# Altium schematic sheet MCU.SchDoc
size A4; SheetNumber: 5; SheetTotal: 9
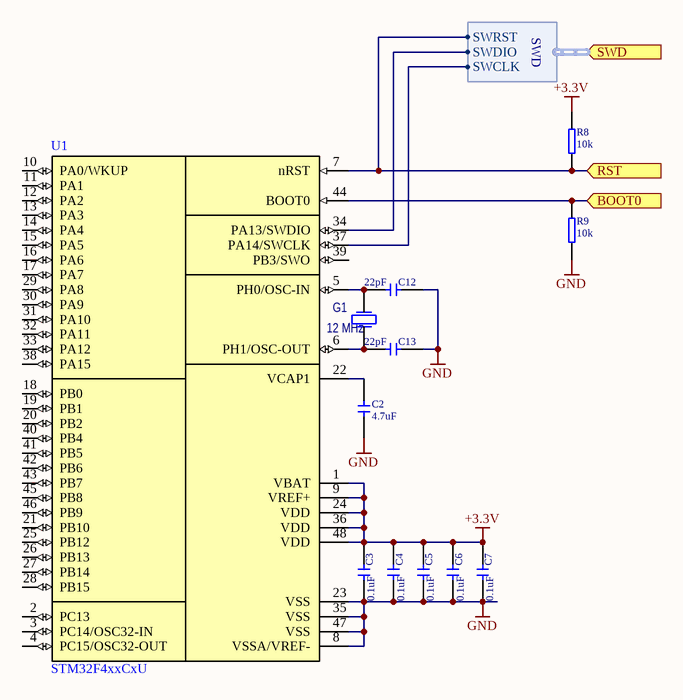
[diagram p0: MCU.SchDoc]

## Parts
C2  value 4.7uF  [CERCAP 0603]
C3  value 0.1uF  [CERCAP 0402]
C4  value 0.1uF  [CERCAP 0402]
C5  value 0.1uF  [CERCAP 0402]
C6  value 0.1uF  [CERCAP 0402]
C7  value 0.1uF  [CERCAP 0402]
C12  value 22pF  [CERCAP 0402]
C13  value 22pF  [CERCAP 0402]
G1  value 12 MHz  [3225]
R8  value 10k  [RES 0402]
R9  value 10k  [RES 0402]
U1  STM32F4xxCxU  [QFN-48]

## Ports
BOOT0 (in), RST (in), SWD (in, harness SWD)

## Harnesses
SWD: SWDIO, SWCLK, SWRST

## Nets
+3.3V: C3.2 C4.2 C5.2 C6.2 C7.2 R8.2 U1.1(VBAT) U1.9(VREF+) U1.24(VDD) U1.36(VDD) U1.48(VDD)
GND: C2.1 C3.1 C4.1 C5.1 C6.1 C7.1 C12.2 C13.2 R9.1 U1.8(VSSA/VREF-) U1.23(VSS) U1.35(VSS) U1.47(VSS)
BOOT0: R9.2 U1.44(BOOT0) ; port BOOT0
RST: R8.1 U1.7(nRST) ; port RST, port SWD.SWRST
NetC2_2: C2.2 U1.22(VCAP1)
NetC12_1: C12.1 G1.2 U1.5(PH0/OSC-IN)
NetC13_1: C13.1 G1.1 U1.6(PH1/OSC-OUT)
NetU1_34: U1.34(PA13/SWDIO) ; port SWD.SWDIO
NetU1_37: U1.37(PA14/SWCLK) ; port SWD.SWCLK

Not connected (* = marked no-connect by the designer): U1 2(PC13) 3(PC14/OSC32-IN) 4(PC15/OSC32-OUT) 10(PA0/WKUP) 11(PA1) 12(PA2) 13(PA3) 14(PA4) 15(PA5) 16(PA6) 17(PA7) 18(PB0) 19(PB1) 20(PB2) 21(PB10) 25(PB12) 26(PB13) 27(PB14) 28(PB15) 29(PA8) 30(PA9) 31(PA10) 32(PA11) 33(PA12) 38(PA15) 39(PB3/SWO) 40(PB4) 41(PB5) 42(PB6) 43(PB7) 45(PB8) 46(PB9)

## Library data of the parts
C2-C7 C12 C13 = !Capacitor: Capacitor; IsSMT: NoSMT; Diel: X7R; Voltage: *
G1 = Crystal: pin to pad: 2>3; IsSMT: NoSMT
R8 R9 = !Resistor: Resistor; IsSMT: NoSMT
U1 = STM32F4xxCxU: Cortex-M4